# Altium schematic sheet Sheet1.SchDoc
size A4; SheetNumber: 2; SheetTotal: 2
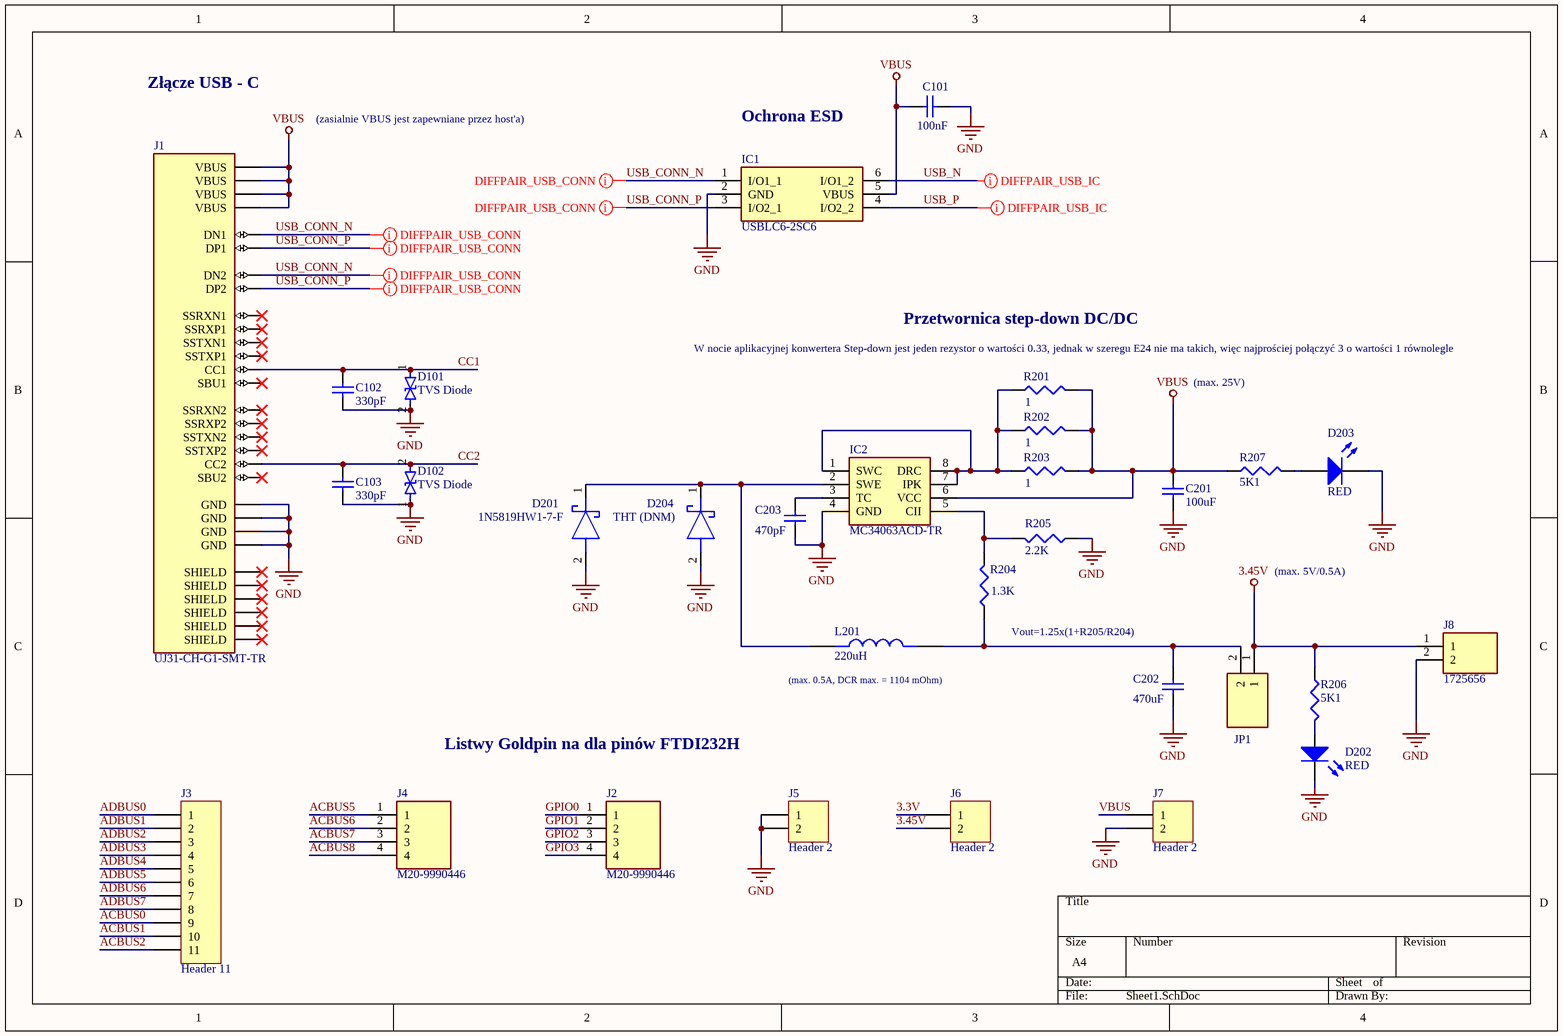
[diagram p0: Sheet1.SchDoc]

## Parts
C101  value 100nF  [1608[0603]]  (hidden comment: Cap Semi)
C102  value 330pF  [1608[0603]]  (hidden comment: Cap Semi)
C103  value 330pF  [1608[0603]]  (hidden comment: Cap Semi)
C201  value 100uF  [1608[0603]]  (hidden comment: Cap Semi)
C202  value 470uF  [1608[0603]]  (hidden comment: Cap Semi)
C203  value 470pF  [1608[0603]]  (hidden comment: Cap Semi)
D101  TVS Diode  [PESD15VW1BCSF - TVS Diode]
D102  TVS Diode  [PESD15VW1BCSF - TVS Diode]
D201  1N5819HW1-7-F  [SODFL3518X115N]
D202  RED  [LEDC2012X80N]
D203  RED  [LEDC2012X80N]
D204  THT (DNM)  [DIOAD1796W86L628D292]
IC1  USBLC6-2SC6  [SOT95P280X145-6N]
IC2  MC34063ACD-TR  [SOIC127P600X175-8N]
J1  UJ31-CH-G1-SMT-TR  [CUI_UJ31-CH-G1-SMT-TR - duplicate]
J2  M20-9990446  [HDRV4W64P0X254_1X4_1016X254X889P]
J3  Header 11  [HDR1X11]
J4  M20-9990446  [HDRV4W64P0X254_1X4_1016X254X889P]
J5  Header 2  [HDR1X2]
J6  Header 2  [HDR1X2]
J7  Header 2  [HDR1X2]
J8  1725656  [1725656]
JP1  5-146277-2  [HDRV2W67P0X254_1X2_467X234X823P]  (value not drawn)
L201  220uH  [242418 FPS]
R201  value 1  [RESC1608X55N]  (hidden comment: Res3)
R202  value 1  [RESC1608X55N]  (hidden comment: Res3)
R203  value 1  [RESC1608X55N]  (hidden comment: Res3)
R204  value 1.3K  [RESC1608X55N]  (hidden comment: Res3)
R205  value 2.2K  [RESC1608X55N]  (hidden comment: Res3)
R206  value 5K1  [RESC1608X55N]  (hidden comment: Res3)
R207  value 5K1  [RESC1608X55N]  (hidden comment: Res3)

## Nets
3.45V: J6.2 J8.1 JP1.1 R206.1
GND: C101.2 C102.1 C103.1 C201.1 C202.1 C203.1 D101.2 D102.1 D201.2(A) D202.2(K) D203.2(K) D204.2(A) IC1.2(GND) IC2.4(GND) J1.A1(GND) J1.A12(GND) J1.B1(GND) J1.B12(GND) J5.1 J5.2 J7.2 J8.2 R205.1
VBUS: C101.1 C201.2 IC1.5(VBUS) IC2.6(VCC) J1.A4(VBUS) J1.A9(VBUS) J1.B4(VBUS) J1.B9(VBUS) J7.1 R201.2 R202.2 R203.2 R207.1
3.3V: J6.1
ACBUS0: J3.9
ACBUS1: J3.10
ACBUS2: J3.11
ACBUS5: J4.1
ACBUS6: J4.2
ACBUS7: J4.3
ACBUS8: J4.4
ADBUS0: J3.1
ADBUS1: J3.2
ADBUS2: J3.3
ADBUS3: J3.4
ADBUS4: J3.5
ADBUS5: J3.6
ADBUS6: J3.7
ADBUS7: J3.8
CC1: C102.2 D101.1 J1.A5(CC1)
CC2: C103.2 D102.2 J1.B5(CC2)
GPIO0: J2.1
GPIO1: J2.2
GPIO2: J2.3
GPIO3: J2.4
USB_CONN_N: IC1.1(I/O1_1) J1.A7(DN1) J1.B7(DN2)
USB_CONN_P: IC1.3(I/O2_1) J1.A6(DP1) J1.B6(DP2)
USB_N: IC1.6(I/O1_2)
USB_P: IC1.4(I/O2_2)
NetC202_2: C202.2 JP1.2 L201.2 R204.1
NetC203_2: C203.2 IC2.3(TC)
NetD201_1: D201.1(K) D204.1(K) IC2.2(SWE) L201.1
NetD202_1: D202.1(A) R206.2
NetD203_1: D203.1(A) R207.2
NetIC2_1: IC2.1(SWC) IC2.7(IPK) IC2.8(DRC) R201.1 R202.1 R203.1
NetIC2_5: IC2.5(CII) R204.2 R205.2

Not connected (* = marked no-connect by the designer): J1 A2(SSTXP1)* A3(SSTXN1)* A8(SBU1)* A10(SSRXN2)* A11(SSRXP2)* B2(SSTXP2)* B3(SSTXN2)* B8(SBU2)* B10(SSRXN1)* B11(SSRXP1)* SH1(SHIELD)* SH2(SHIELD)* SH3(SHIELD)* SH4(SHIELD)* SH5(SHIELD)* SH6(SHIELD)*

## Layout directives
differential pair; differential pair class USB_CONN: USB_CONN_N, USB_CONN_P
differential pair; differential pair class *: USB_N, USB_P

## Notes on the sheet
- Złącze USB - C
- (zasialnie VBUS jest zapewniane przez host'a)
- Ochrona ESD
- (near R201) W nocie aplikacyjnej konwertera Step-down jest jeden rezystor o wartości 0.33, jednak w szeregu E24 nie ma takich, więc najprościej połączyć 3 o wartości 1 równolegle
- Przetwornica step-down DC/DC
- (max. 25V)
- (max. 5V/0.5A)
- Vout=1.25x(1+R205/R204)
- (near L201) (max. 0.5A, DCR max. = 1104 mOhm)
- Listwy Goldpin na dla pinów FTDI232H

## Library data of the parts
C101-C103 C201-C203 = Cap Semi: Capacitor (Semiconductor SIM Model); Published: 8-Jun-2000; LatestRevisionDate: 29-May-2009; LatestRevisionNote: IPC-7351 Footprint Added.; PackageReference: C1206; Publisher: Altium Limited; PackageDescription: Chip Capacitor
D101 D102 = PESD15VW1BCSFYL: PESD15VW1BCSFYL - Extremely low capacitance bidirectional ESD protection diode
D201 D204 = 1N5819HW1-7-F: Schottky Diode; Manufacturer_Name: Diodes Inc.; Datasheet Link: https://www.diodes.com/assets/Datasheets/1N5819HW1.pdf; Height: 1.15mm; Manufacturer_Part_Number: 1N5819HW1-7-F; Mouser Part Number: 621-1N5819HW1-7-F; Mouser Price/Stock: https://www.mouser.co.uk/ProductDetail/Diodes-Incorporated/1N5819HW1-7-F?qs=60RJRzIpcl9ACQG7Zn63jQ%3D%3D; Arrow Part Number: 1N5819HW1-7-F; Arrow Price/Stock: https://www.arrow.com/en/products/1n5819hw1-7-f/diodes-incorporated?region=nac
D202 D203 = LED2: Typical RED, GREEN, YELLOW, AMBER GaAs LED; Published: 8-Jun-2000; LatestRevisionDate: 17-Jul-2002; LatestRevisionNote: Re-released for DXP Platform.; PackageVersion: Feb-2002; PackageReference: 3.2X1.6X1.1; Publisher: Altium Limited; PackageDescription: SM LED; 2 Flat Leads
IC1 = USBLC6-2SC6: Integrated Circuit; Manufacturer_Name: STMicroelectronics; Datasheet Link: http://www.st.com/st-web-ui/static/active/en/resource/technical/document/datasheet/CD00050750.pdf; Height: 1.45mm; Manufacturer_Part_Number: USBLC6-2SC6; Mouser Part Number: 511-USBLC6-2SC6; Mouser Price/Stock: https://www.mouser.co.uk/ProductDetail/STMicroelectronics/USBLC6-2SC6?qs=po45yt2pPpu%2FhNIlwQdTlg%3D%3D; Arrow Part Number: USBLC6-2SC6; Arrow Price/Stock: https://www.arrow.com/en/products/usblc6-2sc6/stmicroelectronics?region=nac
IC2 = MC34063ACD-TR: Integrated Circuit; Manufacturer_Name: STMicroelectronics; Datasheet Link: http://www.st.com/st-web-ui/static/active/en/resource/technical/document/datasheet/CD00001232.pdf; Height: 1.75mm; Manufacturer_Part_Number: MC34063ACD-TR; Mouser Part Number: 511-MC34063ACD-TR; Mouser Price/Stock: https://www.mouser.co.uk/ProductDetail/STMicroelectronics/MC34063ACD-TR?qs=zDcCjb1ShEnlEhOFqqejBw%3D%3D; Arrow Part Number: MC34063ACD-TR; Arrow Price/Stock: https://www.arrow.com/en/products/mc34063acd-tr/stmicroelectronics?region=nac
J1 = UJ31-CH-G1-SMT-TR: Type C, USB 3.1 Gen 2, 5 A, Right Angle, Surface Mount _SMT_ , USB Receptacle; MF: CUI Devices; CUI_purchase_URL: https://www.cuidevices.com/product/interconnect/connectors/usb-connectors/uj31-ch-g1-smt-tr?utm_source=snapeda.com&utm_medium=referral&utm_campaign=snapedaBOM; Price: None; SnapEDA_Link: https://www.snapeda.com/parts/UJ31-CH-G1-SMT-TR/CUI%20Devices/view-part/2754415/?ref=snap; Package: None; Availability: Unavailable; Value: *; MP: UJ31-CH-G1-SMT-TR
J2 J4 = M20-9990446: Connector; Manufacturer_Name: Harwin; Datasheet Link: https://www.harwin.com/products/M20-9990446/; Height: 8.89mm; Manufacturer_Part_Number: M20-9990446; Mouser Part Number: 855-M20-9990446; Mouser Price/Stock: https://www.mouser.co.uk/ProductDetail/Harwin/M20-9990446?qs=ulE8k0yEMYaW%252BOM7jiG6%252Bw%3D%3D
J3 = Header 11: Header, 11-Pin; LatestRevisionDate: 17-Jul-2002; LatestRevisionNote: Re-released for DXP Platform.; Publisher: Altium Limited
J5-J7 = Header 2: Header, 2-Pin; LatestRevisionDate: 17-Jul-2002; LatestRevisionNote: Re-released for DXP Platform.; Publisher: Altium Limited
J8 = 1725656: Screw terminal; Manufacturer_Name: Phoenix Contact; Datasheet Link: https://www.phoenixcontact.com/online/portal/us/?uri=pxc-oc-itemdetail:pid=1725656&library=usen&pcck=P-11-01-05&tab=1&selectedCategory=ALL; Height: 8.65mm; Manufacturer_Part_Number: 1725656; Mouser Part Number: 651-1725656; Mouser Price/Stock: https://www.mouser.co.uk/ProductDetail/Phoenix-Contact/1725656?qs=Ul7CXFMnlWWQeccayYbRmw%3D%3D; Arrow Part Number: 1725656; Arrow Price/Stock: https://www.arrow.com/en/products/1725656/phoenix-contact?region=nac
JP1 = 5-146277-2: Connector; Manufacturer_Name: TE Connectivity; Datasheet Link: https://www.te.com/commerce/DocumentDelivery/DDEController?Action=srchrtrv&DocNm=146277&DocType=Customer+Drawing&DocLang=English; Height: 8.23mm; Manufacturer_Part_Number: 5-146277-2; Mouser Part Number: 571-5-146277-2; Mouser Price/Stock: https://www.mouser.co.uk/ProductDetail/TE-Connectivity/5-146277-2/?qs=bwpFY26eRVdSYoepUea0uA%3D%3D; Arrow Part Number: 5-146277-2; Arrow Price/Stock: https://www.arrow.com/en/products/5-146277-2/te-connectivity
L201 = 242418FPS-221M-01: Inductor 220uH, tolerance=20%, max. current=0.5A, DCR max. = 1104 mOhm
R201-R207 = Res3: Resistor; Published: 8-Jun-2000; LatestRevisionDate: 29-May-2009; LatestRevisionNote: IPC-7351 Footprint Added.; PackageReference: J1-0603; Publisher: Altium Limited; PackageDescription: Chip Resistor